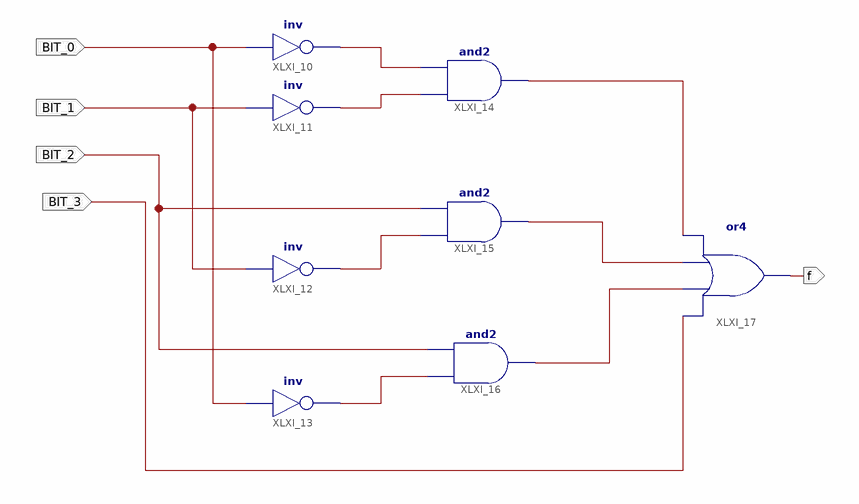
[diagram p0: schematic sheet 1]
// Xilinx ISE schematic SEG_F.sch (spartan6) as structural Verilog: 8 symbols, 5 ports
module SEG_F (
  input  BIT_0,
  input  BIT_1,
  input  BIT_2,
  input  BIT_3,
  output f
);

  wire XLXN_23, XLXN_24, XLXN_25, XLXN_26, XLXN_27, XLXN_28, XLXN_29;

  not XLXI_10 (XLXN_23, BIT_0);
  not XLXI_11 (XLXN_24, BIT_1);
  not XLXI_12 (XLXN_25, BIT_1);
  not XLXI_13 (XLXN_26, BIT_0);
  and XLXI_14 (XLXN_29, XLXN_24, XLXN_23);
  and XLXI_15 (XLXN_28, XLXN_25, BIT_2);
  and XLXI_16 (XLXN_27, XLXN_26, BIT_2);
  or XLXI_17 (f, BIT_3, XLXN_27, XLXN_28, XLXN_29);
endmodule
